# EAGLE schematic MySXMotion (EAGLE 6.6.0)
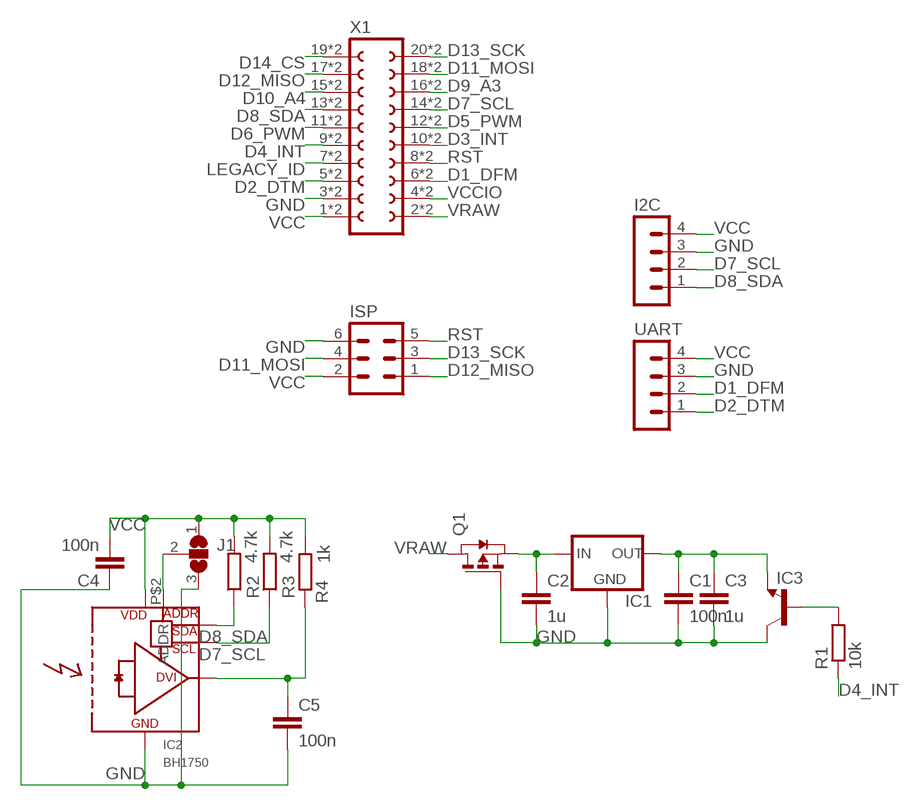
[diagram p0: schematic, sheet 1]

## Parts
C1  100n  C-EUC0603  [C0603]
C2  1u  C-EUC0603  [C0603]
C3  1u  C-EUC0805  [C0805]
C4  100n  C-EUC0603  [C0603]
C5  100n  C-EUC0603  [C0603]
I2C  MA04-1  [MA04-1]
IC1  XC63FPM  [SOT23]
IC2  BH1750  [WSOF6]
IC3  -NPN-TO5  [TO5]
ISP  MA03-2  [MA03-2]
J1  SJ2W  [SJ_2]
Q1  PMOSSOT23  [SOT-23]
R1  10k  R-EU_R0603  [R0603]
R2  4.7k  R-EU_R0603  [R0603]
R3  4.7k  R-EU_R0603  [R0603]
R4  1k  R-EU_R0603  [R0603]
UART  MA04-1  [MA04-1]
X1  FE10-2  [FE10-2]

## Nets
D1_DFM: UART.2 X1.6 X1.P$6
D2_DTM: UART.1 X1.5 X1.P$5
D3_INT: X1.10 X1.P$10
D4_INT: R1.1 X1.9 X1.P$9
D5_PWM: X1.12 X1.P$12
D6_PWM: X1.11 X1.P$11
D7_SCL: I2C.2 IC2.P$6(SCL) R3.1 X1.14 X1.P$14
D8_SDA: I2C.1 IC2.P$4(SDA) R2.1 X1.13 X1.P$13
D9_A3: X1.16 X1.P$16
D10_A4: X1.15 X1.P$15
D11_MOSI: ISP.4 X1.18 X1.P$18
D12_MISO: ISP.1 X1.17 X1.P$17
D13_SCK: ISP.3 X1.20 X1.P$20
D14_CS: X1.19 X1.P$19
GND [power]: C1.2 C2.2 C3.2 C4.1 C5.2 I2C.3 IC1.1(GND) IC2.P$3(GND) IC3.3(C) ISP.6 J1.3 Q1.3(G) UART.3 X1.3 X1.P$3
LEGACY_ID: X1.7 X1.P$7
N$1: C5.1 IC2.P$5(DVI) R4.2
N$2: IC2.P$2(ADDR) J1.2
N$3: IC3.2(B) R1.2
N$4 [power]: C2.1 IC1.3(IN) Q1.2(S)
N$7 [power]: C1.1 C3.1 IC1.2(OUT) IC3.1(E)
RST: ISP.5 X1.8 X1.P$8
VCC [power]: C4.2 I2C.4 IC2.P$1(VCC) ISP.2 J1.1 R2.2 R3.2 R4.1 UART.4 X1.1 X1.P$1
VCCIO [power]: X1.4 X1.P$4
VRAW [power]: Q1.1(D) X1.2 X1.P$2

## Library data of the parts
C1-C5 = rcl:C-EU: CAPACITOR, European symbol
I2C UART = con-lstb:MA04-1: PIN HEADER; OC_FARNELL: unknown; OC_NEWARK: unknown
IC1 = v-reg:XC63FP: Positiv Voltage Regulators www.torex.co.jp/english/product/pro02/pdf/0201_xc62fp.pdf
IC2 = bh1750:BH1750
IC3 = transistor:*-NPN-: NPN Transistror BF959 corrected 2008.03.06
ISP = con-lstb:MA03-2: PIN HEADER; OC_FARNELL: unknown; OC_NEWARK: unknown
J1 = jumper:SJ2W: SMD solder JUMPER
Q1 = zetex:PMOSSOT23: MOS FET; OC_FARNELL: unknown; OC_NEWARK: unknown
R1-R4 = rcl:R-EU_: RESISTOR, European symbol
X1 = my-con-lsta:FE10-2: FEMALE HEADER; OC_FARNELL: unknown; OC_NEWARK: unknown

## Net classes
0 default: width 0.203 mm
1 power: width 0.508 mm